# Altium project PCB_testboard.PrjPcb
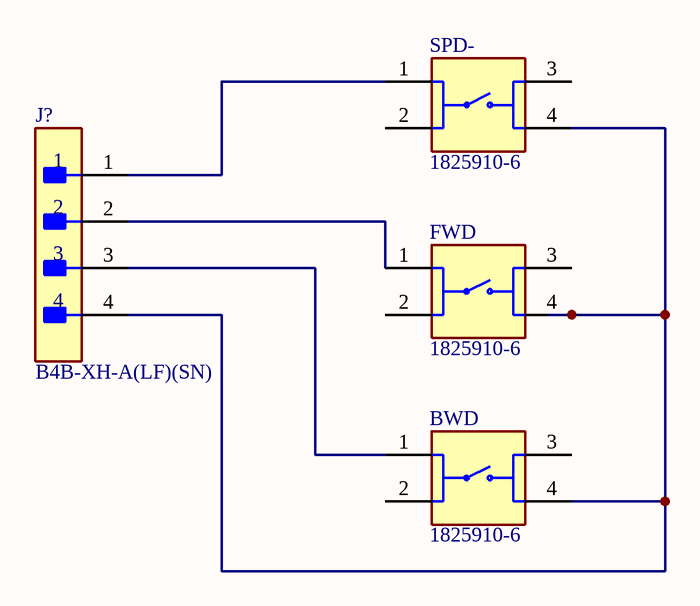
[diagram p0: Sheet1.SchDoc]
1 sheet, 4 parts. Net scope: global (net labels, ports and power ports of the same name join across sheets).
Board file: PCB1.PcbDoc

## Sheet Sheet1.SchDoc
size A; SheetNumber: 1; SheetTotal: 1

### Parts
BWD  1825910-6  [SW_1825910-6-4]
FWD  1825910-6  [SW_1825910-6-4]
J?  B4B-XH-A(LF)(SN)  [FP-B4B-XH-A_LF_SN-MFG]
SPD-  1825910-6  [SW_1825910-6-4]

### Nets
NetBWD_1: BWD.1 J?.3
NetBWD_4: BWD.4 FWD.4 J?.4 SPD-.4
NetFWD_1: FWD.1 J?.2
NetJ?_1: J?.1 SPD-.1

Not connected (* = marked no-connect by the designer): BWD 2 3; FWD 2 3; SPD- 2 3

### Library data of the parts
BWD FWD SPD- = 1825910-6: FSM4JH=6MM TACT SWITCH, HIGH TEMP; MF: TE Connectivity; SnapEDA_Link: https://www.snapeda.com/parts/1825910-6/TE+Connectivity+Alcoswitch+Switches/view-part/?ref=snap; Package: None; Value: *; MP: 1825910-6; Check_prices: https://www.snapeda.com/parts/1825910-6/TE+Connectivity+Alcoswitch+Switches/view-part/?ref=eda
J? = CMP-17439-000250-1: CONN HEADER VERT 4POS 2.5MM; Number of Contacts: 4; Contact Resistance: 20mR; Voltage Rating: 250V; Max Current Rating: 3A; Gender: Male; Wire/Cable Gauge: 22AWG; Mated Stacking Heights: 9.8mm; Insulation Resistance: 1GR; Orientation: Straight; Contact Type: Male Pin; Contact Finish - Mating: TIN; Series: XH; Max Voltage Rating (AC): 250V; Lead Pitch: 2.5mm; Contact Shape: Square; Insulation Color: Natural; Termination: Solder; Lead Free: Lead Free; Voltage Rating (AC): 250V; Number of Rows: 1; Flammability Rating: UL94 V-0; Number of Positions: 4; Max Operating Temperature: 85°C; Package Quantity: 500; Mount: Through Hole; REACH SVHC: No SVHC; Connector Type: Header; Insulation Material: Nylon; Fastening Type: Detent; Min Operating Temperature: -25°C; Housing Color: White; Packaging: Bulk; Contact Plating: Tin; Contact Material: Brass; Max Voltage Rating (DC): 250V; Housing Material: Polyamide; Color: Natural; Material: Polyamide; Pitch: 2.5mm; Depth: 5.75mm; Current Rating: 3A; Length: 12.4mm